# Altium schematic sheet UCC28070_Control.SchDoc
size A2
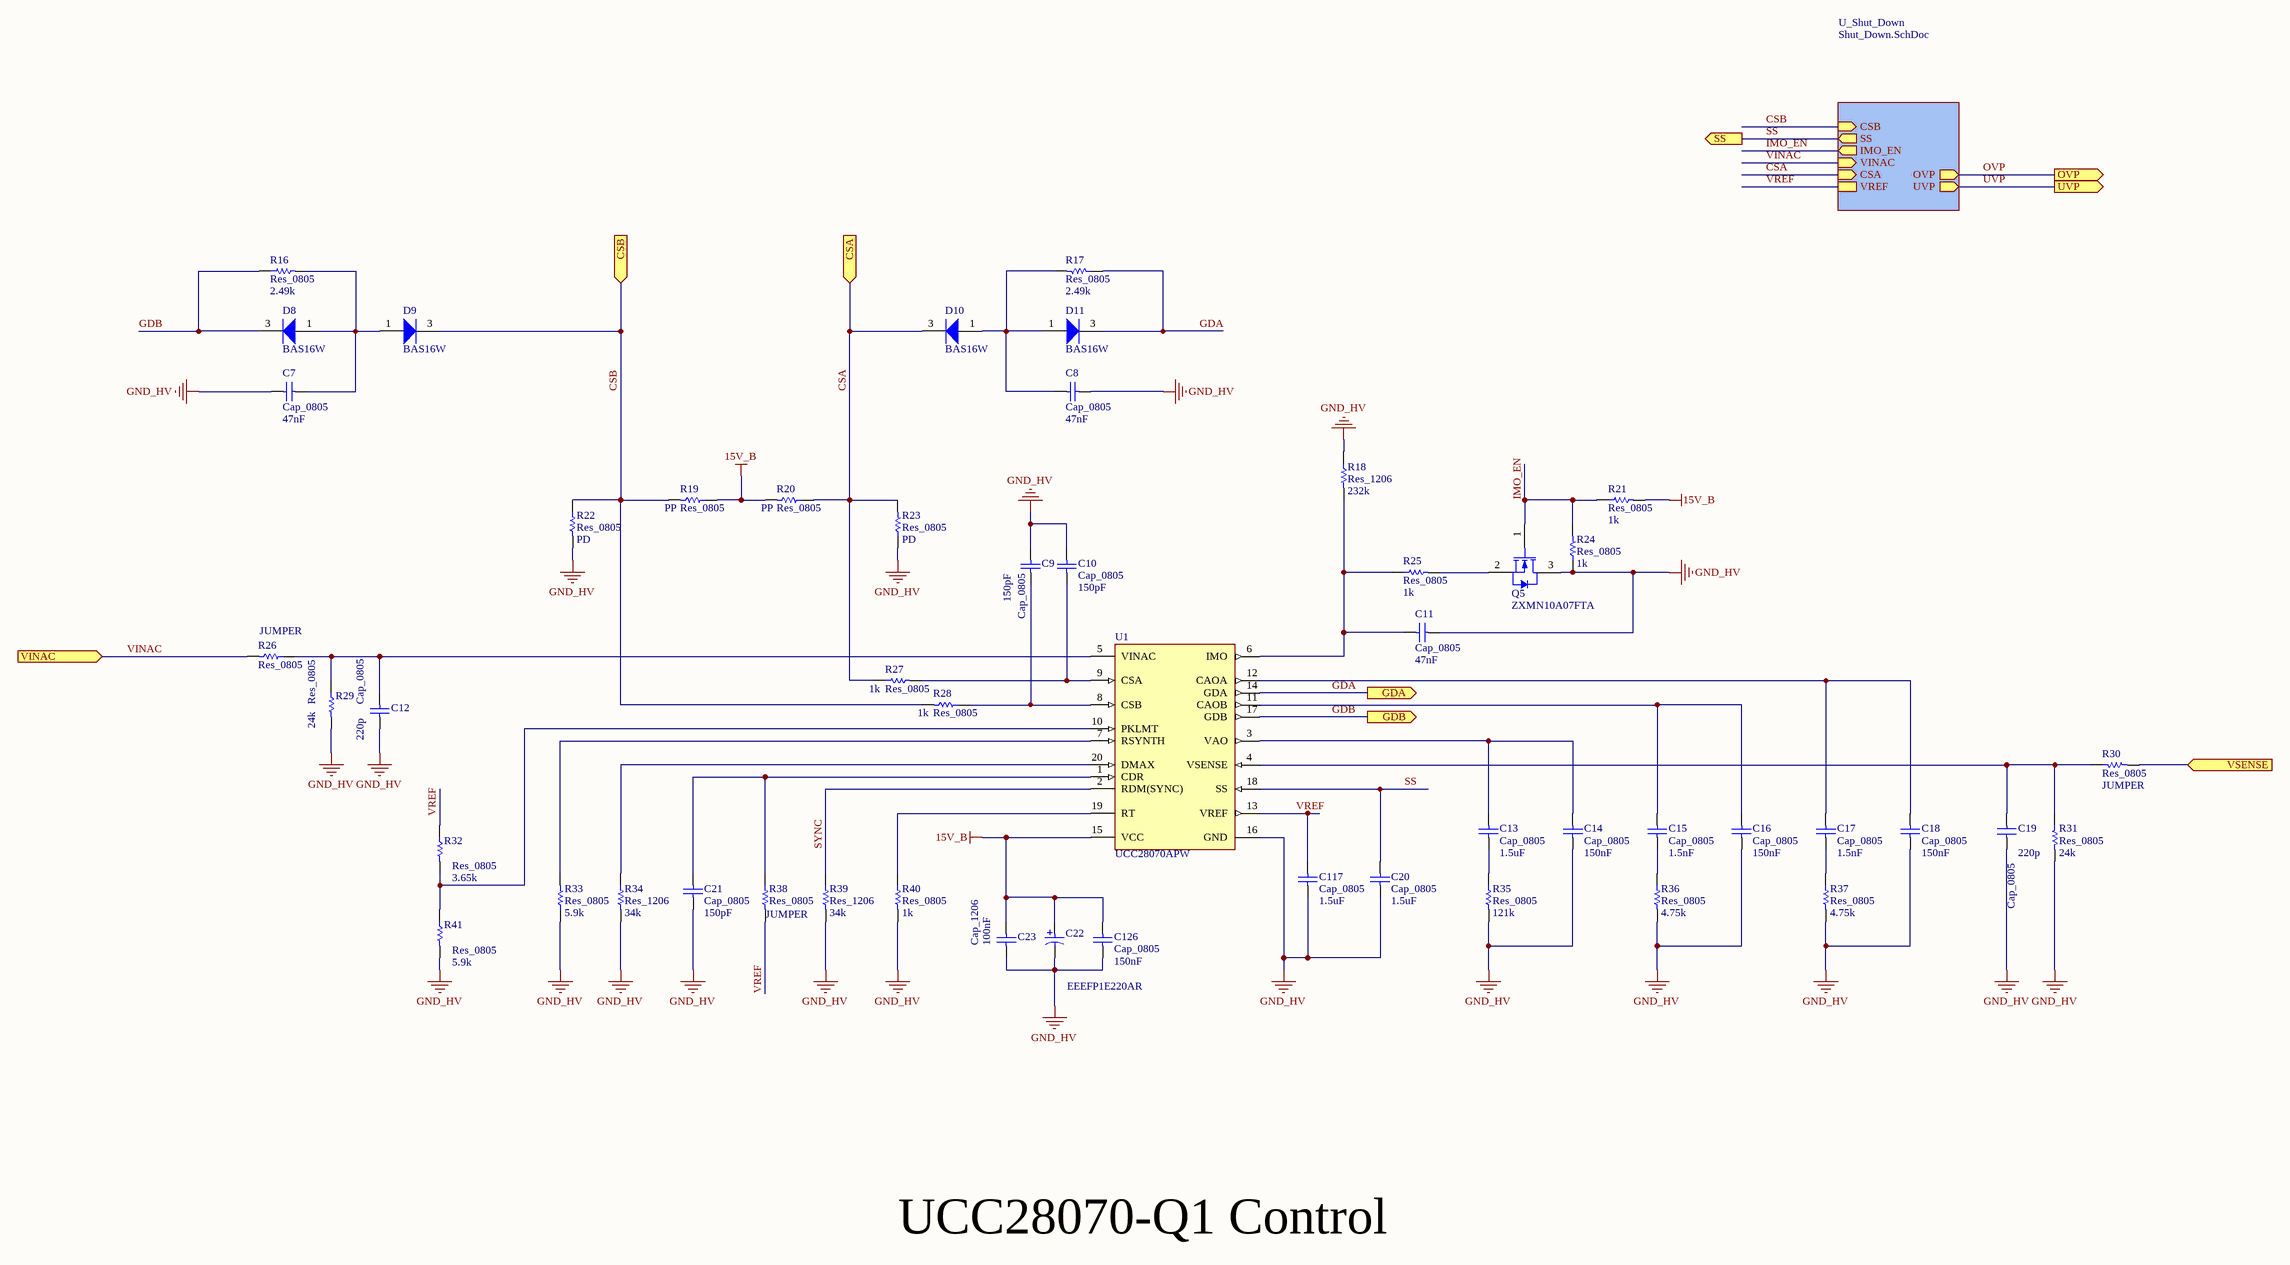
[diagram p0: UCC28070_Control.SchDoc]

## Parts
C7  Cap_0805  Size: 47nF  [SMD-0805C]
C8  Cap_0805  Size: 47nF  [SMD-0805C]
C9  Cap_0805  Size: 150pF  [SMD-0805C]
C10  Cap_0805  Size: 150pF  [SMD-0805C]
C11  Cap_0805  Size: 47nF  [SMD-0805C]
C12  Cap_0805  Size: 220p  [SMD-0805C]
C13  Cap_0805  Size: 1.5uF  [SMD-0805C]
C14  Cap_0805  Size: 150nF  [SMD-0805C]
C15  Cap_0805  Size: 1.5nF  [SMD-0805C]
C16  Cap_0805  Size: 150nF  [SMD-0805C]
C17  Cap_0805  Size: 1.5nF  [SMD-0805C]
C18  Cap_0805  Size: 150nF  [SMD-0805C]
C19  Cap_0805  Size: 220p  [SMD-0805C]
C20  Cap_0805  Size: 1.5uF  [SMD-0805C]
C21  Cap_0805  Size: 150pF  [SMD-0805C]
C22  EEEFP1E220AR  [PNSC-FP-V-C_V]
C23  Cap_1206  value 100nF  [SMD-1206C]
C117  Cap_0805  Size: 1.5uF  [SMD-0805C]
C126  Cap_0805  Size: 150nF  [SMD-0805C]
D8  BAS16W  [SOT95P278X110-3N]
D9  BAS16W  [SOT95P278X110-3N]
D10  BAS16W  [SOT95P278X110-3N]
D11  BAS16W  [SOT95P278X110-3N]
Q5  ZXMN10A07FTA  [DIOD-SOT23-3_D_V]
R16  Res_0805  value 2.49k  [WRIS-KSKE_0805_H=0.6mm]
R17  Res_0805  value 2.49k  [WRIS-KSKE_0805_H=0.6mm]
R18  Res_1206  value 232k  [WRIS-KSKE_1206_H=0.6mm]
R19  Res_0805  value PP  [WRIS-KSKE_0805_H=0.6mm]
R20  Res_0805  value PP  [WRIS-KSKE_0805_H=0.6mm]
R21  Res_0805  value 1k  [WRIS-KSKE_0805_H=0.6mm]
R22  Res_0805  value PD  [WRIS-KSKE_0805_H=0.6mm]
R23  Res_0805  value PD  [WRIS-KSKE_0805_H=0.6mm]
R24  Res_0805  value 1k  [WRIS-KSKE_0805_H=0.6mm]
R25  Res_0805  value 1k  [WRIS-KSKE_0805_H=0.6mm]
R26  Res_0805  value JUMPER  [WRIS-KSKE_0805_H=0.6mm]
R27  Res_0805  value 1k  [WRIS-KSKE_0805_H=0.6mm]
R28  Res_0805  value 1k  [WRIS-KSKE_0805_H=0.6mm]
R29  Res_0805  value 24k  [WRIS-KSKE_0805_H=0.6mm]
R30  Res_0805  value JUMPER  [WRIS-KSKE_0805_H=0.6mm]
R31  Res_0805  value 24k  [WRIS-KSKE_0805_H=0.6mm]
R32  Res_0805  value 3.65k  [WRIS-KSKE_0805_H=0.6mm]
R33  Res_0805  value 5.9k  [WRIS-KSKE_0805_H=0.6mm]
R34  Res_1206  value 34k  [WRIS-KSKE_1206_H=0.6mm]
R35  Res_0805  value 121k  [WRIS-KSKE_0805_H=0.6mm]
R36  Res_0805  value 4.75k  [WRIS-KSKE_0805_H=0.6mm]
R37  Res_0805  value 4.75k  [WRIS-KSKE_0805_H=0.6mm]
R38  Res_0805  value JUMPER  [WRIS-KSKE_0805_H=0.6mm]
R39  Res_1206  value 34k  [WRIS-KSKE_1206_H=0.6mm]
R40  Res_0805  value 1k  [WRIS-KSKE_0805_H=0.6mm]
R41  Res_0805  value 5.9k  [WRIS-KSKE_0805_H=0.6mm]
U1  UCC28070APW  [TSOP65P640X120_HS-21N]

## Sub-sheets
U_Shut_Down = Shut_Down.SchDoc: CSB (in), SS (out), IMO_EN (out), VINAC (in), CSA (in), VREF, OVP (out), UVP (out)

## Ports
CSA (in), CSB (in), GDA (out), GDB (out), OVP (out), SS (out), UVP (out), VINAC (in), VSENSE (in)

## Nets
15V_B: C22.1 C23.1 C126.1 R19.1 R20.2 R21.2 U1.15(VCC)
GND_HV: C7.1 C8.1 C9.1 C10.1 C11.2 C12.2 C14.2 C16.2 C18.2 C19.2 C20.2 C21.2 C22.2 C23.2 C117.2 C126.2 Q5.3(D) R18.1 R22.2 R23.1 R24.1 R29.2 R31.2 R33.1 R34.2 R35.2 R36.2 R37.2 R39.2 R40.2 R41.2 U1.16(GND)
CSA: D10.3(K) R20.1 R23.2 R27.1 ; port CSA, sheet U_Shut_Down/CSA
CSB: D9.3(K) R19.2 R22.1 R28.2 ; port CSB, sheet U_Shut_Down/CSB
GDA: D11.3(K) R17.1 U1.14(GDA) ; port GDA
GDB: D8.3(K) R16.1 U1.17(GDB) ; port GDB
IMO_EN: Q5.1(G) R21.1 R24.2 ; sheet U_Shut_Down/IMO_EN
OVP: port OVP, sheet U_Shut_Down/OVP
SS: C20.1 U1.18(SS) ; port SS, sheet U_Shut_Down/SS
SYNC: R39.1 U1.2(RDM(SYNC))
UVP: port UVP, sheet U_Shut_Down/UVP
VINAC: R26.2 ; port VINAC, sheet U_Shut_Down/VINAC
VREF: C117.1 R32.1 R38.2 U1.13(VREF) ; sheet U_Shut_Down/VREF
VSENSE: R30.2 ; port VSENSE
NetC7_2: C7.2 D8.1(A) D9.1(A) R16.2
NetC8_2: C8.2 D10.1(A) D11.1(A) R17.2
NetC9_2: C9.2 R28.1 U1.8(CSB)
NetC10_2: C10.2 R27.2 U1.9(CSA)
NetC11_1: C11.1 R18.2 R25.1 U1.6(IMO)
NetC12_1: C12.1 R26.1 R29.1 U1.5(VINAC)
NetC13_1: C13.1 C14.1 U1.3(VAO)
NetC13_2: C13.2 R35.1
NetC15_1: C15.1 C16.1 U1.11(CAOB)
NetC15_2: C15.2 R36.1
NetC17_1: C17.1 C18.1 U1.12(CAOA)
NetC17_2: C17.2 R37.1
NetC19_1: C19.1 R30.1 R31.1 U1.4(VSENSE)
NetC21_1: C21.1 R38.1 U1.1(CDR)
NetQ5_2: Q5.2(S) R25.2
NetR32_2: R32.2 R41.1 U1.10(PKLMT)
NetR33_2: R33.2 U1.7(RSYNTH)
NetR34_1: R34.1 U1.20(DMAX)
NetR40_1: R40.1 U1.19(RT)

## Notes on the sheet
- UCC28070-Q1 Control

## Library data of the parts
C7-C15 C17 C19-C21 C117 = Cap: Capacitor; Value: 100pF; Published: 8-Jun-2000; LatestRevisionDate: 17-Jul-2002; LatestRevisionNote: Re-released for DXP Platform.; PackageReference: RAD-0.3; Publisher: Altium Limited; PackageDescription: Radial Cap, Thru-Hole; 2 Leads; 0.3 in Pin Spacing
C16 C18 C126 = Cap: Capacitor; Value: 330pF; Published: 8-Jun-2000; LatestRevisionDate: 17-Jul-2002; LatestRevisionNote: Re-released for DXP Platform.; PackageReference: RAD-0.3; Publisher: Altium Limited; PackageDescription: Radial Cap, Thru-Hole; 2 Leads; 0.3 in Pin Spacing
C22 = CMP-2000-06213-1: Aluminum Electrolytic Capacitor, 22 uF, +/- 20%, 25 V, 2-Pin SMD (Size Code C), -55 to 105 degC, RoHS, Tape and Reel; Manufacturer: Panasonic; ESR (Equivalent Series Resistance): 0.36O; Ripple Current: 240mA; Capacitance: 22µF; Lifetime@Temperature: 2000Hrs@105°C; Rated Voltage: 25V; Type: Can; Package Reference: FP-V-C; Package Description: 2-Pin Electrolytic Aluminum Capacitor, Body 5.3 x 5.3 mm; Operating Temp Range: -55to+105°C; Mounting Technology: SurfaceMount; Datasheet URL: http://industrial.panasonic.com/cdbs/www-data/pdf/RDE0000/ABA0000C1184.pdf; Case Size/Dimension: Ø5x5.8mm; Operating Temp-Max: 105°C; Package URL: http://industrial.panasonic.com/cdbs/www-data/pdf/RDE0000/DME0000COL48.pdf; Datasheet Version: 03/2016; Series: FP; Manufacturer URL: http://www.panasonic.com/
C23 = Cap: Capacitor; Published: 8-Jun-2000; LatestRevisionDate: 17-Jul-2002; LatestRevisionNote: Re-released for DXP Platform.; PackageReference: RAD-0.3; Publisher: Altium Limited; PackageDescription: Radial Cap, Thru-Hole; 2 Leads; 0.3 in Pin Spacing
D8-D11 = BAS16: Silicon Switching Diode, SOT323, Reel, Green; Manufacturer: Infineon; IR (max): 100Â nA; Configuration: Single; VBR (min): 85Â V; VR (max): 80Â V; trr (max): 4Â ns; Green: TRUE; VF (max): 1.25Â V; IF (max): 250Â mA; Mounting Technology: Surface Mount; PackageReference: SOT323; ComponentLink2URL: http://www.infineon.com/dgdl/bas16series.pdf?folderId=db3a30431400ef6801141b5844e103ea&fileId=db3a30431400ef6801141b93811b03ff; Halogen-free: TRUE; ComponentLink2Description: Datasheet; PartNumber: BAS16W; ComponentLink1Description: Manufacturer URL; ComponentLink3URL: http://www.infineon.com/dgdl/SOT323-Package_Overview.pdf?folderId=db3a30431936bc4b0119533e1dcb3c92&fileId=db3a30431936bc4b011953495f283cb1; ComponentLink1URL: http://www.infineon.com/; PackageDescription: 3-Pin Small Outline Transistor Package, 1.25 x 2 mm Body, 0.65 mm Pitch; ComponentLink3Description: Package Specification
Q5 = CMP-2000-07433-1: N-Channel Enhancement Mode MOSFET, 100 V, -55 to 150 degC, 3-Pin SOT23, RoHS, Tape and Reel; Manufacturer: Diodes Inc; Drain-to-Source Voltage [Vdss]: 100V; Qg Gate Charge: 2.9nC; Rated Power Dissipation: 625mW; Drain-Source On Resistance-Max: 0.7O; Package Description: 3-Pin Small Outline Transistor, Body 2.9 x 1.3 mm, Pitch 0.96 mm; Channel Type: N-Channel; Mounting Technology: SurfaceMount; Datasheet Version: Rev. 6-2, 08/2012; Manufacturer URL: http://www.diodes.com/; Datasheet URL: http://www.diodes.com/_files/datasheets/ZXMN10A07F.pdf; Package Reference: SOT23-3
R16-R41 = Res1: Resistor; Published: 8-Jun-2000; LatestRevisionDate: 17-Jul-2002; LatestRevisionNote: Re-released for DXP Platform.; PackageReference: AXIAL-0.3; Publisher: Altium Limited; PackageDescription: Axial Device, Thru-Hole; 2 Leads; 0.3 in Pin Spacing
U1 = CMP-0333-00336-2: Two-Phase Interleaved CCM PFC Controller with Extended Frequency Range (10 kHz to 300 kHz), 21 V, 20 mA Startup Current, -40 to 125 degC, 20-pin TSSOP (PW), Green (RoHS & no Sb/Br); Manufacturer: Texas Instruments; UVLO Thresholds On/Off(V): 10.2/9.2; Practical Operating Frequency(Max)(MHz): 0.3; Vref(V): 6; Average Current Mode: TRUE; Operating Supply(Max)(V): 21; Duty Cycle(Max)(%): 99; Rating: Catalog; Vref tol(%): 3; Operating Supply Current(mA): 20; PackageReference: PW0020A; PartNumber: UCC28070APW; ComponentLink1URL: http://www.ti.com/general/docs/lit/getliterature.tsp?genericPartNumber=UCC28070A&fileType=pdf; Eco-Plan: Green (RoHS & no Sb/Br); Mounting Technology: Surface Mount; PackageVersion: revG, Feb-2011; ComponentLink1Description: Datasheet; Interleaved: TRUE; Code_JEDEC: MO-153; > 750W Applications: TRUE; PackageDescription: 20-Pin Plastic Thin Small Outline Package 6.5 x 4.4 mm Body ,0.65 mm Pitch; Startup Current(mA): 20; OVP: TRUE; DatasheetVersion: SLUSAW0